# Altium schematic sheet Acond_Elec.SchDoc: CSN Detector V4_1
size A4; Author: RCP; DrawnBy: RCP; Address1: LIM-HGGM; Address3: RCP; DocumentNumber: 1; Revision: 1; SheetNumber: 1; SheetTotal: 2; PageSetup: Record=PageOptions|CenterHorizontal=True|CenterVertical=True|PrintScale=0.97|XCorrection=1.00|YCorrection=1.00|PrintKind=0|BorderSize=5000000|LeftOffset=0|BottomOffset=0|Orientation=2|PaperLength=2970|PaperWidth=2100|Scale=100|PaperSource=7|PrintQuality=600|MediaType=1|DitherType=10|PaperKind=A4|PrintScaleMode=1
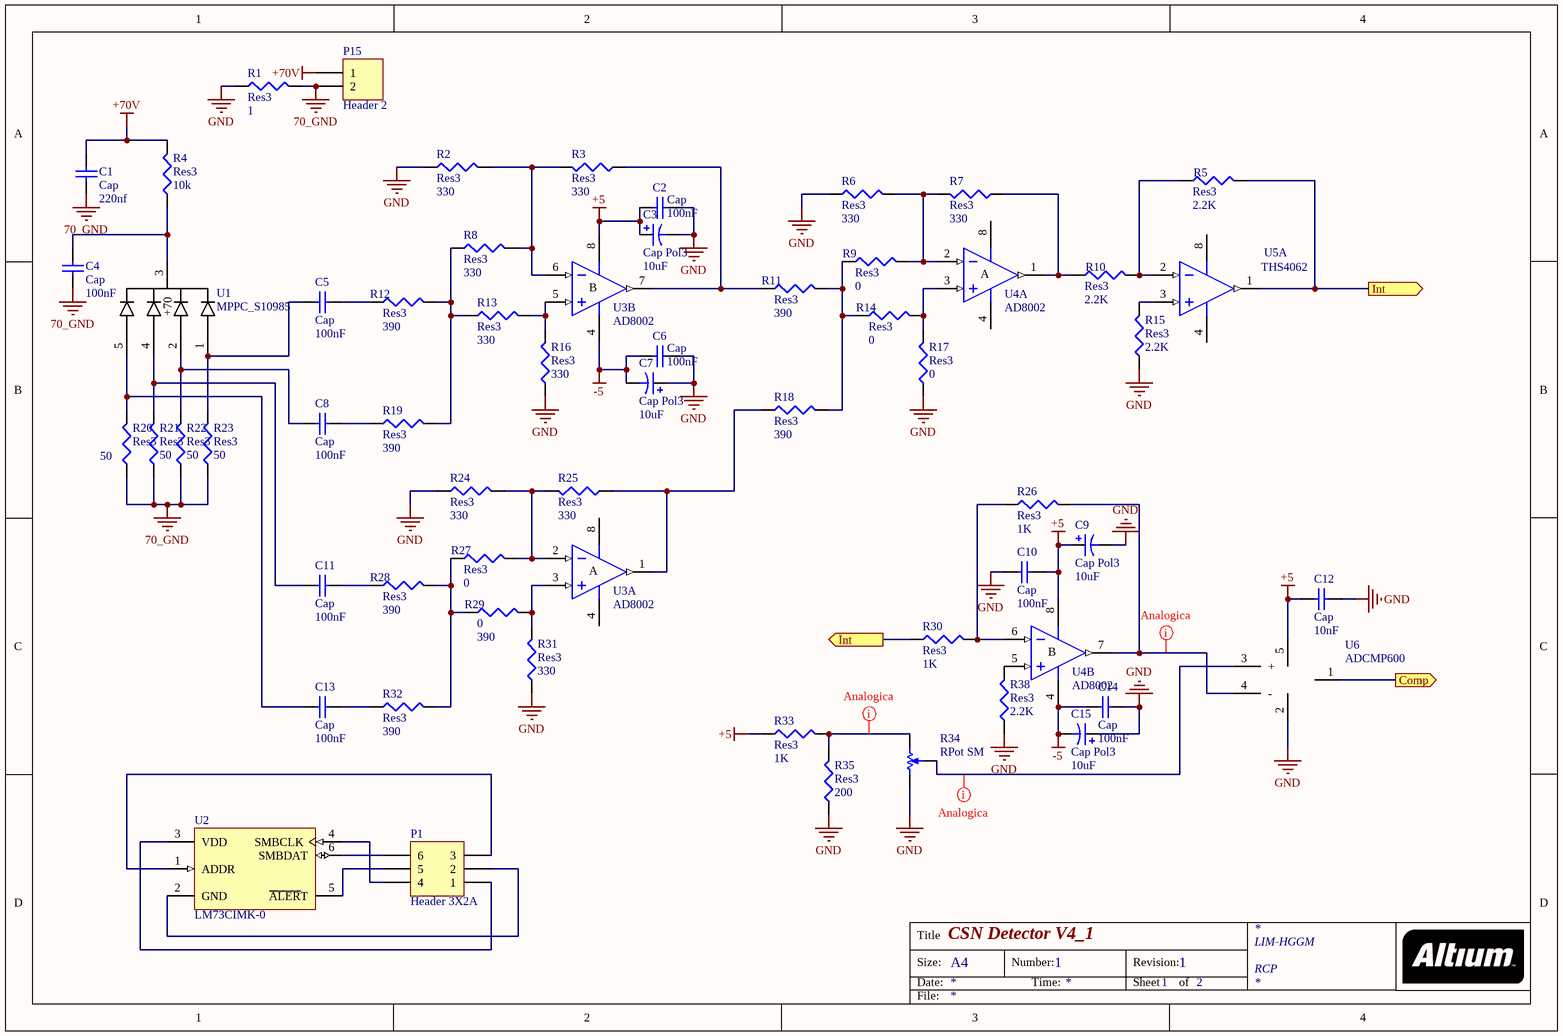
[diagram p0: Acond_Elec.SchDoc]

## Parts
C1  Cap  value 220nf  [C0805]
C2  Cap  value 100nF  [6-0805_N]
C3  Cap Pol3  value 10uF  [6-0805_N]
C4  Cap  value 100nF  [C0805]
C5  Cap  value 100nF  [C0805]
C6  Cap  value 100nF  [6-0805_N]
C7  Cap Pol3  value 10uF  [6-0805_N]
C8  Cap  value 100nF  [C0805]
C9  Cap Pol3  value 10uF  [6-0805_N]
C10  Cap  value 100nF  [6-0805_N]
C11  Cap  value 100nF  [C0805]
C12  Cap  value 10nF  [6-0805_N]
C13  Cap  value 100nF  [C0805]
C14  Cap  value 100nF  [6-0805_N]
C15  Cap Pol3  value 10uF  [6-0805_N]
P1  Header 3X2A  [HDR2X3_CEN]
P15  Header 2  [HDR1X2]
R1  Res3  value 1  [6-0805_N]
R2  Res3  value 330  [6-0805_N]
R3  Res3  value 330  [6-0805_N]
R4  Res3  value 10k  [6-0805_N]
R5  Res3  value 2.2K  [6-0805_N]
R6  Res3  value 330  [6-0805_N]
R7  Res3  value 330  [6-0805_N]
R8  Res3  value 330  [6-0805_N]
R9  Res3  value 0  [6-0805_N]
R10  Res3  value 2.2K  [6-0805_N]
R11  Res3  value 390  [6-0805_N]
R12  Res3  value 390  [6-0805_N]
R13  Res3  value 330  [6-0805_N]
R14  Res3  value 0  [6-0805_N]
R15  Res3  value 2.2K  [6-0805_N]
R16  Res3  value 330  [6-0805_N]
R17  Res3  value 0  [6-0805_N]
R18  Res3  value 390  [6-0805_N]
R19  Res3  value 390  [6-0805_N]
R20  Res3  value 50  [6-0805_N]
R21  Res3  value 50  [6-0805_N]
R22  Res3  value 50  [6-0805_N]
R23  Res3  value 50  [6-0805_N]
R24  Res3  value 330  [6-0805_N]
R25  Res3  value 330  [6-0805_N]
R26  Res3  value 1K  [6-0805_N]
R27  Res3  value 0  [6-0805_N]
R28  Res3  value 390  [6-0805_N]
R29  0  value 390  [6-0805_N]
R30  Res3  value 1K  [6-0805_N]
R31  Res3  value 330  [6-0805_N]
R32  Res3  value 390  [6-0805_N]
R33  Res3  value 1K  [6-0805_N]
R34  RPot SM  [POT4MM-2]
R35  Res3  value 200  [6-0805_N]
R38  Res3  value 2.2K  [6-0805_N]
U1  MPPC_S10985  [S10985_HAM]
U2  LM73CIMK-0  [MK06A_N]
U3  AD8002  [SO-8_M]  (parts A,B of 2)
U4  AD8002  [SO-8_M]  (parts A,B of 2)
U5  THS4062  [S8_N]  (part A of 2)
U6  ADCMP600  [SOT23-5_N]

## Ports
Comp (out), Int (out)

## Nets
70_GND: C1.1 C4.1 P15.2 R1.2 R20.1 R21.1 R22.1 R23.1
+5: C2.2 C3.1 C9.1 C10.2 C12.1 R33.1 U3.8(V+) U4.8(V+) U6.5
+70V: C1.2 P15.1 R4.2
-5: C6.2 C7.2 C14.1 C15.2 U3.4(V-) U4.4(V-)
GND: C2.1 C3.2 C6.1 C7.1 C9.2 C10.1 C12.2 C14.2 C15.1 R1.1 R2.1 R6.1 R15.1 R16.1 R17.1 R24.1 R31.1 R34.CCW(-) R35.1 R38.1 U6.2
Comp: U6.1 ; port Comp
Int: R5.2 R30.1 U5.1(OUT) ; port Int
NetC4_2: C4.2 R4.1 U1.3(+70)
NetC5_1: C5.1 R23.2 U1.1(Pin1)
NetC5_2: C5.2 R12.1
NetC8_1: C8.1 R22.2 U1.2(Pin2)
NetC8_2: C8.2 R19.1
NetC11_1: C11.1 R21.2 U1.4
NetC11_2: C11.2 R28.1
NetC13_1: C13.1 R20.2 U1.5
NetC13_2: C13.2 R32.1
NetP1_1: P1.1 U2.3(VDD)
NetP1_2: P1.2 U2.2(GND)
NetP1_3: P1.3 U2.1(ADDR)
NetP1_4: P1.4 U2.4(SMBCLK)
NetP1_5: P1.5 U2.5(~{ALER}T)
NetP1_6: P1.6 U2.6(SMBDAT)
NetR2_2: R2.2 R3.2 R8.2 U3.6(IN-)
NetR3_1: R3.1 R11.1 U3.7(OUT)
NetR5_1: R5.1 R10.2 U5.2(IN-)
NetR6_2: R6.2 R7.2 R9.2 U4.2(IN-)
NetR7_1: R7.1 R10.1 U4.1(OUT)
NetR8_1: R8.1 R12.2 R13.1 R19.2
NetR9_1: R9.1 R11.2 R14.1 R18.2
NetR13_2: R13.2 R16.2 U3.5(IN+)
NetR14_2: R14.2 R17.2 U4.3(IN+)
NetR15_2: R15.2 U5.3(IN+)
NetR18_1: R18.1 R25.1 U3.1(OUT)
NetR24_2: R24.2 R25.2 R27.2 U3.2(IN-)
NetR26_1: R26.1 R30.2 U4.6(IN-)
NetR26_2: R26.2 U4.7(OUT) U6.4(-)
NetR27_1: R27.1 R28.2 R29.1 R32.2
NetR29_2: R29.2 R31.2 U3.3(IN+)
NetR33_2: R33.2 R34.CW(+) R35.2
NetR34_W: R34.W U6.3(+)
NetR38_2: R38.2 U4.5(IN+)

Not connected (* = marked no-connect by the designer): U5 4(V-) 8(V+)

## Layout directives
net class analog: NetR26_2, NetR33_2, NetR34_W

## Notes on the sheet
- Title
- Size:
- Date:
- A4
- Number:
- Time:
- Revision:
- Sheet
- of
- File:
- (in symbol AD8002AR, part A) A
- (in symbol AD8002AR, part B) B

## Library data of the parts
C1 C2 C4-C6 C8 C10-C14 = Cap: Capacitor; Published: 8-Jun-2000; LatestRevisionDate: 17-Jul-2002; LatestRevisionNote: Re-released for DXP Platform.; PackageReference: RAD-0.3; Publisher: Altium Limited; PackageDescription: Radial Cap, Thru-Hole; 2 Leads; 0.3 in Pin Spacing
C3 C7 C9 C15 = Cap Pol3: Polarized Capacitor (Surface Mount); Published: 8-Jun-2000; LatestRevisionDate: 29-May-2009; LatestRevisionNote: IPC-7351 Footprint Added.; PackageReference: C0805; Publisher: Altium Limited; PackageDescription: Chip Capacitor
P1 = Header 3X2A: Header, 3-Pin, Dual row; LatestRevisionDate: 17-Jul-2002; LatestRevisionNote: Re-released for DXP Platform.; Publisher: Altium Limited
P15 = Header 2: Header, 2-Pin; LatestRevisionDate: 17-Jul-2002; LatestRevisionNote: Re-released for DXP Platform.; Publisher: Altium Limited
R1-R33 R35 R38 = Res3: Resistor; Published: 8-Jun-2000; LatestRevisionDate: 29-May-2009; LatestRevisionNote: IPC-7351 Footprint Added.; PackageReference: J1-0603; Publisher: Altium Limited; PackageDescription: Chip Resistor
R34 = RPot SM: Square Trimming Potentiometer; Published: 17-Dec-2003; DatasheetVersion: Oct-2003; PackageReference: POT4MM-2; Publisher: Altium Limited; PackageDescription: Square Trimming Potentiometer; ComponentLink1Description: Manufacturer Link; ComponentLink1URL: http://bourns.com/2/search.html
U2 = LM73CIMK-0: 2.7V, 11- to 14- Bit Digital Temperature Sensor with 2-Wire Interface, 6-pin Tiny SOT23; Manufacturer: National Semiconductor; PackageTopMarking: T730*XTT; PowerWise: Y; CompType: Temp Sensor IC; Published: 4-Dec-2008; DatasheetVersion: May-2009; PackageVersion: revE, Nov-2008; PackageReference: MK06A; Publisher: Altium Limited; PackageDescription: Molded TSOT, 2.97 x 1.65 x 0.87mm Body, 6 Lead, 0.95mm Pitch; Supplier 1: Farnell; Supplier Part Number 1: 1312598; PartNumber: LM73CIMK-0; RoHS: Y; PinCount: 6; Code_JEDEC: MO-193-AA; Code_IPC: SOT26A-6; ComponentLink1Description: LM73 Datasheet; ComponentLink1URL: http://www.national.com/ds/LM/LM73.pdf; ComponentLink2Description: LM73 Web Page; ComponentLink2URL: http://www.national.com/pf/LM/LM73.html; ComponentLink3Description: MK06A Package Page; ComponentLink3URL: http://www.national.com/packaging/folders/mk06a.html
U3 U4 = AD8002AR: Dual 600MHz, 50mW Current Feedback Amplifier; Published: 8-Jun-2000; LatestRevisionDate: 13-Apr-2006; LatestRevisionNote: IPC-7351 Footprint Added.; DatasheetVersion: REV. C 1999; PackageVersion: revA; PackageReference: SO-8; Publisher: Altium Limited; PackageDescription: 8-Pin Small Outline Integrated Circuit 1.27 mm Pitch; Code_JEDEC: MS-012-AA; Code_IPC: SOIC127P600-8; ComponentLink1Description: Manufacturer Link; ComponentLink1URL: http://www.analog.com/en/prod/0,,759_786_AD8002%2C00.html; ComponentLink2Description: Datasheet; ComponentLink2URL: http://www.analog.com/UploadedFiles/Data_Sheets/147523773AD8002_d.pdf
U5 = LT1253CS8: Low Cost Dual Video Amplifier; Note: 1003; Published: 8-Jun-2000; LatestRevisionDate: 13-Apr-2006; LatestRevisionNote: IPC-7351 Footprint Added.; DatasheetVersion: 1996; PackageReference: S8; Publisher: Altium Limited; PackageDescription: 8-Pin Small Outline Integrated Circuit 1.27 mm Pitch; Code_JEDEC: MS-012-AA; Code_IPC: SOIC127P600-8; ComponentLink1Description: Manufacturer Link; ComponentLink1URL: http://www.linear.com/; ComponentLink2Description: Datasheet; ComponentLink2URL: http://www.linear.com/pc/downloadDocument.do?navId=H0,C1,C1154,C1009,C1022,P1423,D1129